# EAGLE design lighting_driver (EAGLE 9.7.0)
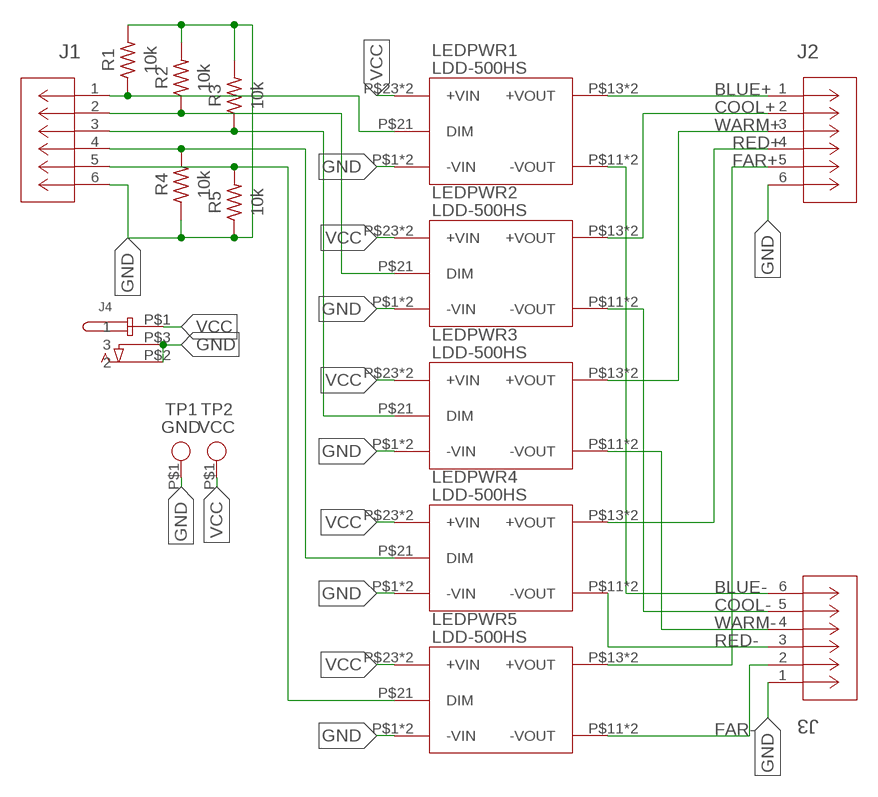
[diagram p0: schematic, sheet 1]

## Parts
J1  MOLEX-MICROLOCK-6PIN  [CON_5055670671]
J2  MOLEX-MICROLOCK-6PIN  [CON_5055670671]
J3  MOLEX-MICROLOCK-6PIN  [CON_5055670671]
J4  DCBARRELJACK  [DCBARRELJACK]
LEDPWR1  LDD-500HS  LDD-300~1000HS  [LDD-300~1000HS]
LEDPWR2  LDD-500HS  LDD-300~1000HS  [LDD-300~1000HS]
LEDPWR3  LDD-500HS  LDD-300~1000HS  [LDD-300~1000HS]
LEDPWR4  LDD-500HS  LDD-300~1000HS  [LDD-300~1000HS]
LEDPWR5  LDD-500HS  LDD-300~1000HS  [LDD-300~1000HS]
R1  10k  R-US_CHIP-0402(1005-METRIC)  [RESC1005X40]
R2  10k  R-US_CHIP-0402(1005-METRIC)  [RESC1005X40]
R3  10k  R-US_CHIP-0402(1005-METRIC)  [RESC1005X40]
R4  10k  R-US_CHIP-0402(1005-METRIC)  [RESC1005X40]
R5  10k  R-US_CHIP-0402(1005-METRIC)  [RESC1005X40]
TP1  GND  TP_CIRCLE_2.5MM  [TP_CIRCLE_2.5MM]
TP2  VCC  TP_CIRCLE_2.5MM  [TP_CIRCLE_2.5MM]

## Nets
BLUE+: J2.1 LEDPWR1.P$13(+VOUT) LEDPWR1.P$14(+VOUT)
BLUE-: J3.6 LEDPWR1.P$11(-VOUT) LEDPWR1.P$12(-VOUT)
COOL+: J2.2 LEDPWR2.P$13(+VOUT) LEDPWR2.P$14(+VOUT)
COOL-: J3.5 LEDPWR2.P$11(-VOUT) LEDPWR2.P$12(-VOUT)
FAR+: J2.5 LEDPWR5.P$13(+VOUT) LEDPWR5.P$14(+VOUT)
FAR-: J3.2 LEDPWR5.P$11(-VOUT) LEDPWR5.P$12(-VOUT)
GND: J1.6 J2.6 J3.1 J4.P$3 LEDPWR1.P$1(-VIN) LEDPWR1.P$2(-VIN) LEDPWR2.P$1(-VIN) LEDPWR2.P$2(-VIN) LEDPWR3.P$1(-VIN) LEDPWR3.P$2(-VIN) LEDPWR4.P$1(-VIN) LEDPWR4.P$2(-VIN) LEDPWR5.P$1(-VIN) LEDPWR5.P$2(-VIN) R1.2 R2.2 R3.2 R4.1 R5.1 TP1.P$1
N$1: J1.1 LEDPWR1.P$21(DIM) R1.1
N$2: J1.2 LEDPWR2.P$21(DIM) R2.1
N$3: J1.3 LEDPWR3.P$21(DIM) R3.1
N$4: J1.4 LEDPWR4.P$21(DIM) R4.2
N$5: J1.5 LEDPWR5.P$21(DIM) R5.2
N$16: J4.P$2
RED+: J2.4 LEDPWR4.P$13(+VOUT) LEDPWR4.P$14(+VOUT)
RED-: J3.3 LEDPWR4.P$11(-VOUT) LEDPWR4.P$12(-VOUT)
VCC: J4.P$1 LEDPWR1.P$23(+VIN) LEDPWR1.P$24(+VIN) LEDPWR2.P$23(+VIN) LEDPWR2.P$24(+VIN) LEDPWR3.P$23(+VIN) LEDPWR3.P$24(+VIN) LEDPWR4.P$23(+VIN) LEDPWR4.P$24(+VIN) LEDPWR5.P$23(+VIN) LEDPWR5.P$24(+VIN) TP2.P$1
WARM+: J2.3 LEDPWR3.P$13(+VOUT) LEDPWR3.P$14(+VOUT)
WARM-: J3.4 LEDPWR3.P$11(-VOUT) LEDPWR3.P$12(-VOUT)

## Library data of the parts
J1-J3 = Molex Micro-Lock PLUS 6-Pin 90deg:MOLEX-MICROLOCK-6PIN
J4 = DC Barrel Jack (Locking):DCBARRELJACK
LEDPWR1-LEDPWR5 = MeanWell NLDD-H Series:LDD-300~1000HS
R1-R5 = Resistor:R-US: Resistor Fixed - ANSI; CATEGORY: Resistor; SUB-CATEGORY: Fixed
TP1 TP2 = Test Point:TP_CIRCLE_2.5MM

## Net classes
0 default: width 0.254 mm, clearance 0.762 mm

## Board
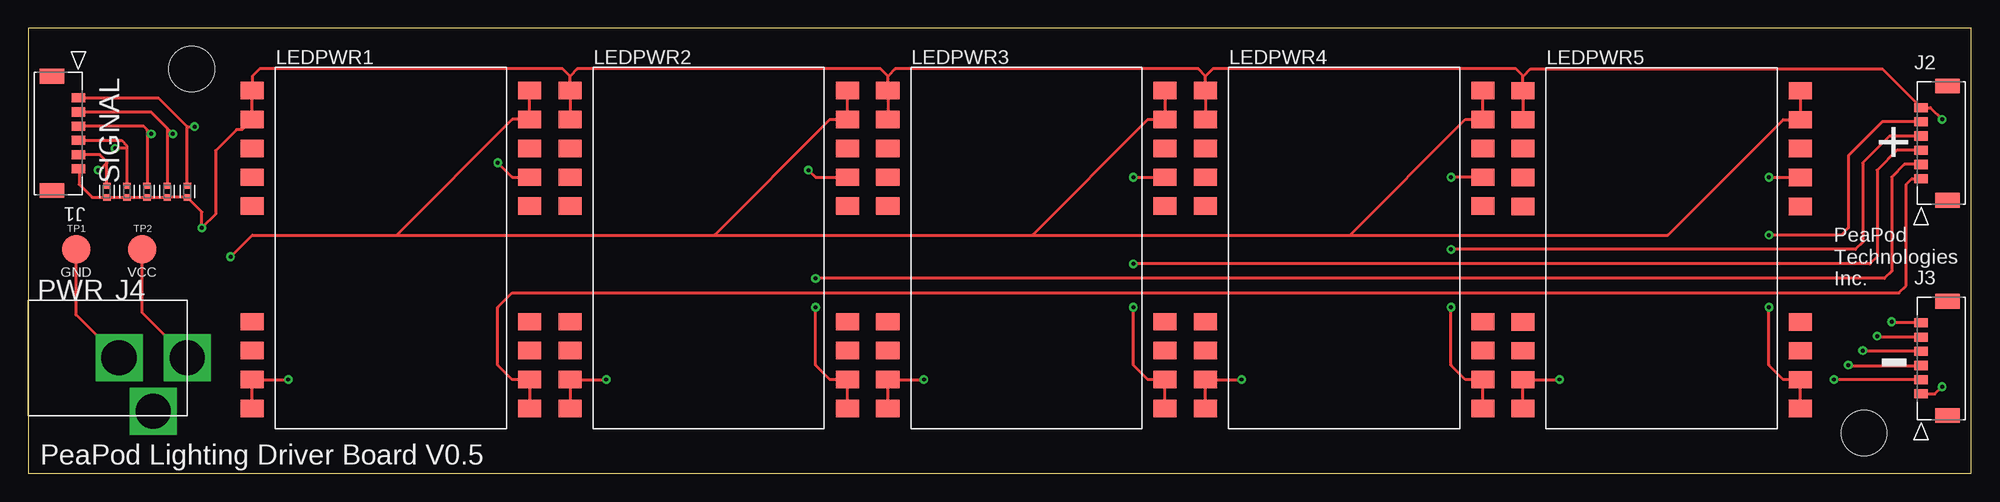
[diagram p1: board, top side]
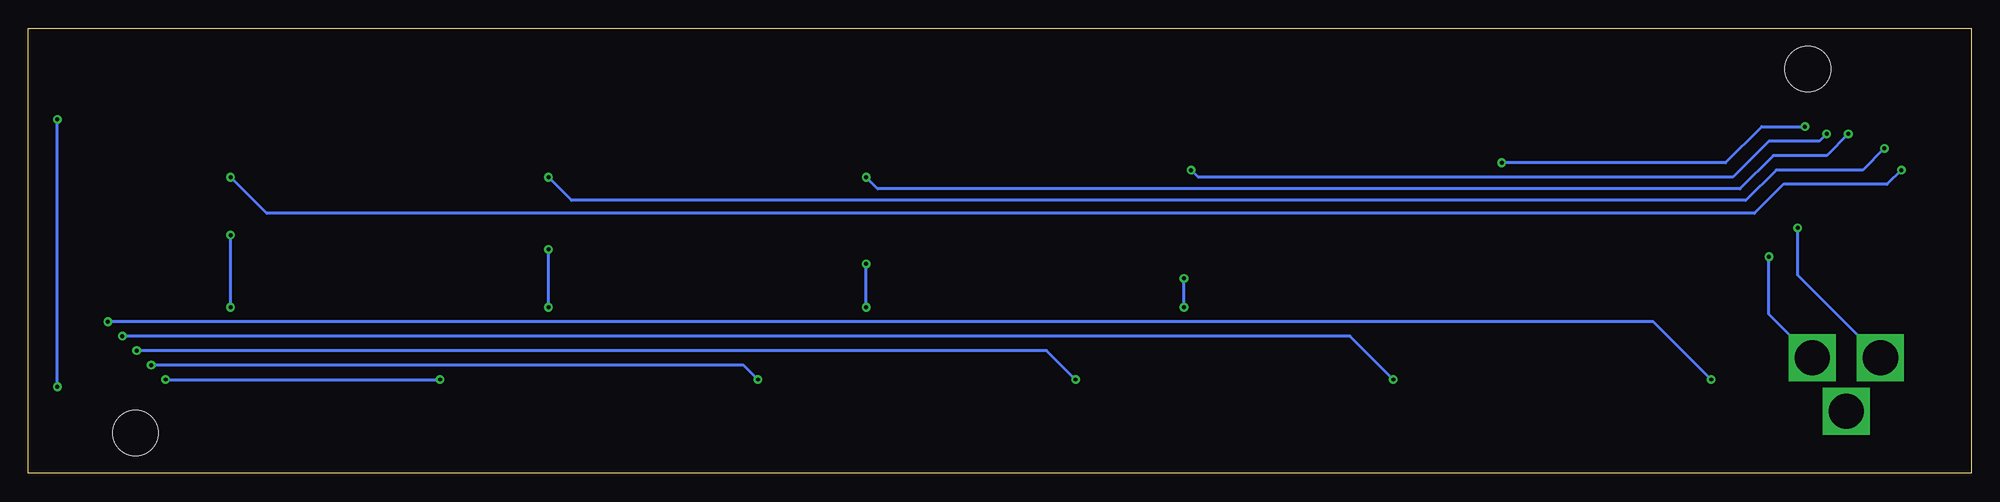
[diagram p2: board, bottom side, seen from below]

Size 170.81 x 39.12 mm. Coordinates in mm from the lower left corner, seen from the top.
Outline: 0,0 170.81,0 170.81,39.12 0,39.12 0,0
Copper layers (1*16): Top 0.035mm / dielectric 1.5mm / Bottom 0.035mm
Design rules "default": minimum track width 6mil, minimum drill 0.35mm, track to track 6mil, track to pad 6mil, pad to pad 6mil, via to via 6mil, smd to smd 6mil, copper to edge 40mil, drill to drill 6mil, minimum pad ring 10mil, minimum via ring 8mil, stop-mask expansion 4mil, vias tented up to drill 0mil, thermal gap 10mil
Holes 4 mm at 14.35,35.56 161.42,3.56

### Footprints (pad centres in the part's own frame; a part is rotated, then mirrored left to right if it is on the bottom)
CON_5055670671 = smd 0.8 x 1.2: 1 0,0; 2 -1.25,0; 3 -2.5,0; 4 -3.75,0; 5 -5,0; 6 -6.25,0 | smd 1.3 x 2.15: NC1 -8.15,2.295; NC2 1.9,2.295
DCBARRELJACK = drill 3.1 square: P$1 0,0; P$2 -3,-4.7; P$3 -6,0
LDD-300~1000HS = smd 1.524 x 2.032: P$1 0,0; P$2 2.54,0; P$3 5.08,0; P$4 7.62,0; P$5 10.16,0; P$9 20.32,0; P$10 22.86,0; P$11 25.4,0; P$12 27.94,0; P$13 27.94,24.384; P$14 25.4,24.384; P$15 22.86,24.384; P$16 20.32,24.384; P$20 10.16,24.384; P$21 7.62,24.384; P$22 5.08,24.384; P$23 2.54,24.384; P$24 0,24.384
RESC1005X40 = smd 0.535 x 0.644: 1 -0.507,0; 2 0.507,0
TP_CIRCLE_2.5MM = smd 2.5 x 2.5: P$1 0,0

### Placement (x,y rotation side)
J1  4.39,33.02 90 top
J2  166.43,25.91 270 top
J3  166.43,6.98 270 top
J4  13.97,10.16 0 top
LEDPWR1  19.68,33.65 270 top
LEDPWR2  47.62,33.65 270 top
LEDPWR3  75.56,33.65 270 top
LEDPWR4  103.5,33.65 270 top
LEDPWR5  131.41,33.64 270 top
R1  13.97,24.76 270 top
R2  12.2,24.76 270 top
R3  10.43,24.76 270 top
R4  8.66,24.76 90 top
R5  6.89,24.76 90 top
TP1  4.19,19.68 0 top
TP2  9.99,19.68 0 top

### Tracks (layer width: path | path; a pad name or v marks a point on that pad's centre or on a via)
BLUE+
  Top 0.254: LEDPWR1.P$13 LEDPWR1.P$14 42.55,8.26 41.27,9.52 41.27,14.6 42.55,15.87 164.47,15.87 165.1,16.51 165.1,25.4 165.61,25.91 J2.1
BLUE-  (via drill 0.35)
  Top 0.254: LEDPWR1.P$12 LEDPWR1.P$11 v22.86,8.26 | J3.6 163.93,13.23 v163.83,13.34
  Bottom 0.254: v22.86,8.26 27.94,13.34 v163.83,13.34
COOL+  (via drill 0.35)
  Top 0.254: LEDPWR2.P$13 LEDPWR2.P$14 70.48,8.26 69.22,9.52 v69.22,14.6 | J2.2 164.95,27.16 163.83,26.04 163.83,17.78 163.19,17.15 v69.22,17.15
  Bottom 0.254: v69.22,14.6 v69.22,17.15
COOL-  (via drill 0.35)
  Top 0.254: LEDPWR2.P$12 LEDPWR2.P$11 v50.8,8.26 | J3.5 162.64,11.98 v162.56,12.07
  Bottom 0.254: v50.8,8.26 54.61,12.07 v162.56,12.07
FAR+  (via drill 0.35)
  Top 0.254: LEDPWR5.P$13 LEDPWR5.P$14 155.78,8.26 154.31,8.26 153.03,9.52 v153.03,14.6 | J2.5 162.99,30.91 160.02,27.94 160.02,21.59 159.38,20.96 v153.03,20.96
  Bottom 0.254: v153.03,14.6 v153.03,20.96
FAR-  (via drill 0.35)
  Top 0.254: LEDPWR5.P$12 LEDPWR5.P$11 134.6,8.23 v134.62,8.26 | J3.2 158.77,8.23 v158.75,8.26
  Bottom 0.254: v158.75,8.26 v134.62,8.26
GND  (via drill 0.35)
  Top 0.254: J4.P$3 4.19,13.94 TP1.P$1 | J1.6 4.45,26.71 4.45,25.4 5.59,24.26 R5.1 R4.1 R3.2 R2.2 R1.2 15.24,22.99 v15.24,21.59 16.45,22.8 16.45,28.38 18.3,30.23 18.8,30.23 LEDPWR1.P$2 LEDPWR1.P$1 19.68,34.93 20.32,35.56 46.99,35.56 47.62,34.93 | 47.62,34.93 LEDPWR2.P$1 LEDPWR2.P$2 | 75.56,34.93 LEDPWR3.P$1 LEDPWR3.P$2 | 75.56,34.93 74.93,35.56 48.26,35.56 47.62,34.93 | 103.5,34.93 LEDPWR4.P$1 LEDPWR4.P$2 | 103.5,34.93 102.87,35.56 76.2,35.56 75.56,34.93 | 131.44,34.93 131.41,34.89 LEDPWR5.P$1 LEDPWR5.P$2 | 131.44,34.93 130.81,35.56 104.14,35.56 103.5,34.93 | 131.44,34.93 132.08,35.56 163.03,35.56 J2.6 167.23,32.16 v168.28,31.12 | J3.1 167.64,6.98 v168.28,7.62
  Bottom 0.254: J4.P$3 15.24,17.43 v15.24,21.59 | v168.28,7.62 v168.28,31.12
N$1  (via drill 0.35)
  Top 0.254: J1.1 11.43,33.02 13.97,30.48 | R1.1 13.97,30.48 | 13.97,30.48 v14.61,30.48 | v41.27,27.3 42.55,26.04 LEDPWR1.P$21
  Bottom 0.254: v41.27,27.3 21.59,27.3 18.41,30.48 v14.61,30.48
N$2  (via drill 0.35)
  Top 0.254: 12.2,30.34 10.78,31.77 J1.2 | 12.2,30.34 R2.1 | 12.2,30.34 v12.7,29.85 | v68.58,26.67 69.22,26.04 LEDPWR2.P$21
  Bottom 0.254: v12.7,29.85 13.34,29.21 17.78,29.21 20.95,26.04 67.94,26.04 v68.58,26.67
N$3  (via drill 0.35)
  Top 0.254: 10.43,30.21 R3.1 | 10.43,30.21 10.12,30.52 J1.3 | 10.43,30.21 v10.79,29.85 | v97.16,26.04 LEDPWR3.P$21
  Bottom 0.254: v10.79,29.85 12.7,27.94 17.4,27.94 20.32,25.02 96.14,25.02 v97.16,26.04
N$4  (via drill 0.35)
  Top 0.254: J1.4 8.2,29.27 8.66,28.8 8.66,28.57 | 8.66,28.57 R4.2 | 8.66,28.57 v7.62,28.57 | LEDPWR4.P$21 v125.09,26.04
  Bottom 0.254: v7.62,28.57 9.53,26.67 17.14,26.67 19.81,24 123.06,24 v125.09,26.04
N$5  (via drill 0.35)
  Top 0.254: R5.2 6.89,27.3 | 6.89,27.3 6.89,27.4 6.27,28.02 J1.5 | 6.89,27.3 6.26,26.67 v6.13,26.67 | v153.03,26.04 155.78,26.04 LEDPWR5.P$21
  Bottom 0.254: v6.13,26.67 7.4,25.4 16.51,25.4 19.05,22.86 149.86,22.86 v153.03,26.04
RED+  (via drill 0.35)
  Top 0.254: LEDPWR4.P$13 LEDPWR4.P$14 126.36,8.26 125.09,9.52 v125.09,14.6 | J2.4 163.64,29.66 161.29,27.3 161.29,20.32 160.66,19.68 v125.09,19.68
  Bottom 0.254: v125.09,14.6 v125.09,19.68
RED-  (via drill 0.35)
  Top 0.254: LEDPWR4.P$12 LEDPWR4.P$11 v106.68,8.26 | J3.3 160.06,9.48 v160.02,9.52
  Bottom 0.254: v106.68,8.26 107.95,9.52 v160.02,9.52
VCC  (via drill 0.35)
  Top 0.254: J4.P$1 9.99,14.14 TP2.P$1 | 32.38,20.96 19.68,20.96 v17.78,19.05 | LEDPWR1.P$24 LEDPWR1.P$23 42.55,31.12 32.38,20.96 | 32.38,20.96 60.33,20.96 | 60.33,20.96 70.48,31.12 LEDPWR2.P$23 LEDPWR2.P$24 | LEDPWR3.P$24 LEDPWR3.P$23 98.42,31.12 88.27,20.96 | 60.33,20.96 88.27,20.96 | 88.27,20.96 116.2,20.96 | LEDPWR4.P$24 LEDPWR4.P$23 126.36,31.12 116.2,20.96 | 116.2,20.96 144.15,20.96 154.28,31.1 LEDPWR5.P$23 LEDPWR5.P$24
  Bottom 0.254: J4.P$1 17.78,13.97 v17.78,19.05
WARM+  (via drill 0.35)
  Top 0.254: LEDPWR3.P$13 LEDPWR3.P$14 98.42,8.26 97.16,9.52 v97.16,14.6 | J2.3 164.3,28.41 162.56,26.67 162.56,19.05 161.93,18.41 v97.16,18.41
  Bottom 0.254: v97.16,14.6 v97.16,18.41
WARM-  (via drill 0.35)
  Top 0.254: LEDPWR3.P$12 LEDPWR3.P$11 v78.74,8.26 | J3.4 161.35,10.73 v161.29,10.79
  Bottom 0.254: v78.74,8.26 81.28,10.79 v161.29,10.79

### Text on the board
tPlace: SIGNAL | + | PWR | PeaPod / Technologies / Inc. | - | PeaPod Lighting Driver Board V0.5